# Altium schematic sheet uart_to_usb.SchDoc
size A; SheetNumber: 6; SheetTotal: 12
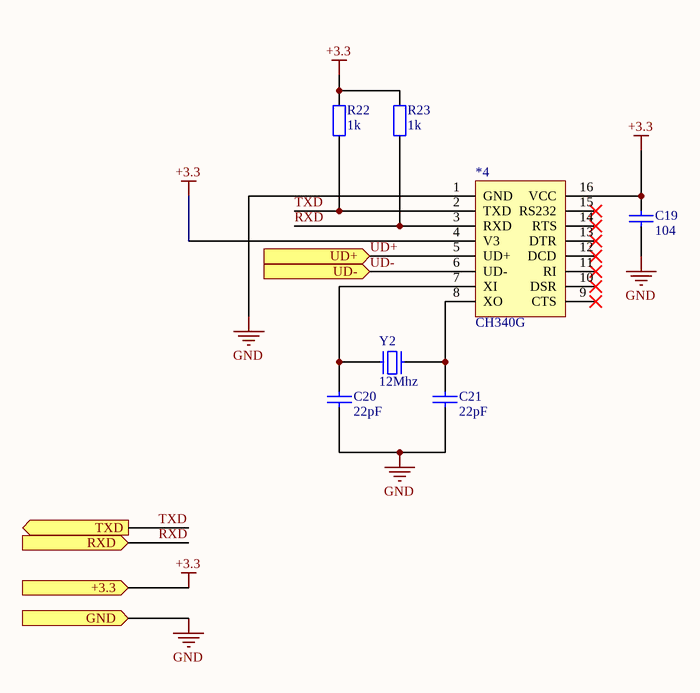
[diagram p0: uart_to_usb.SchDoc]

## Parts
*4  CH340G  [CH340G]
C19  104  [tu 0603]
C20  22pF  [tu 0603]
C21  22pF  [tu 0603]
R22  1k  [tro smd 0805]
R23  1k  [tro smd 0805]
Y2  12Mhz  [Thach Anh 2 chan cam]

## Ports
+3.3 (in), GND (in), RXD (in), TXD (out), UD+ (in), UD- (in)

## Nets
+3.3: *4.4(V3) *4.16(VCC) C19.1 R22.2 R23.2 ; port +3.3
GND: *4.1(GND) C19.2 C20.2 C21.2 ; port GND
RXD: *4.3(RXD) R23.1 ; port RXD
TXD: *4.2(TXD) R22.1 ; port TXD
UD+: *4.5(UD+) ; port UD+
UD-: *4.6(UD-) ; port UD-
Net*4_7: *4.7(XI) C20.1 Y2.1
Net*4_8: *4.8(XO) C21.1 Y2.2

Not connected (* = marked no-connect by the designer): *4 9(CTS)* 10(DSR)* 11(RI)* 12(DCD)* 13(DTR)* 14(RTS)* 15(RS232)*

## Library data of the parts
C19 = Tu 0603 104 50V 10%: Dán; Don_Vi: Con; So_Chan: 2; Ten_Linh_Kien: Tụ 0603 104-100nF 10% 50V; Ma_Hang: MH004568; Chung_Loai: Dán; Kieu_Chan: *
C20 C21 = Tu 0603 22pF 50V 10%: Dán; Don_Vi: Con; So_Chan: 2; Ten_Linh_Kien: Tụ 0603 22pF 50V 10%; Ma_Hang: MH004570; Chung_Loai: Dán; Kieu_Chan: *
R22 R23 = Tro 0805 1% 1k: Dán; Don_Vi: Con; So_Chan: 2; Ten_Linh_Kien: Trở 0805 1% 1k; Ma_Hang: MH005468; Chung_Loai: Dán; Kieu_Chan: *
Y2 = Thach Anh 2 chan Cam: Crystal For all Crystal 2pin.; Value: 4Mhz